# Altium schematic sheet PCBfly.SchDoc
size A3; SheetNumber: 1; SheetTotal: 1
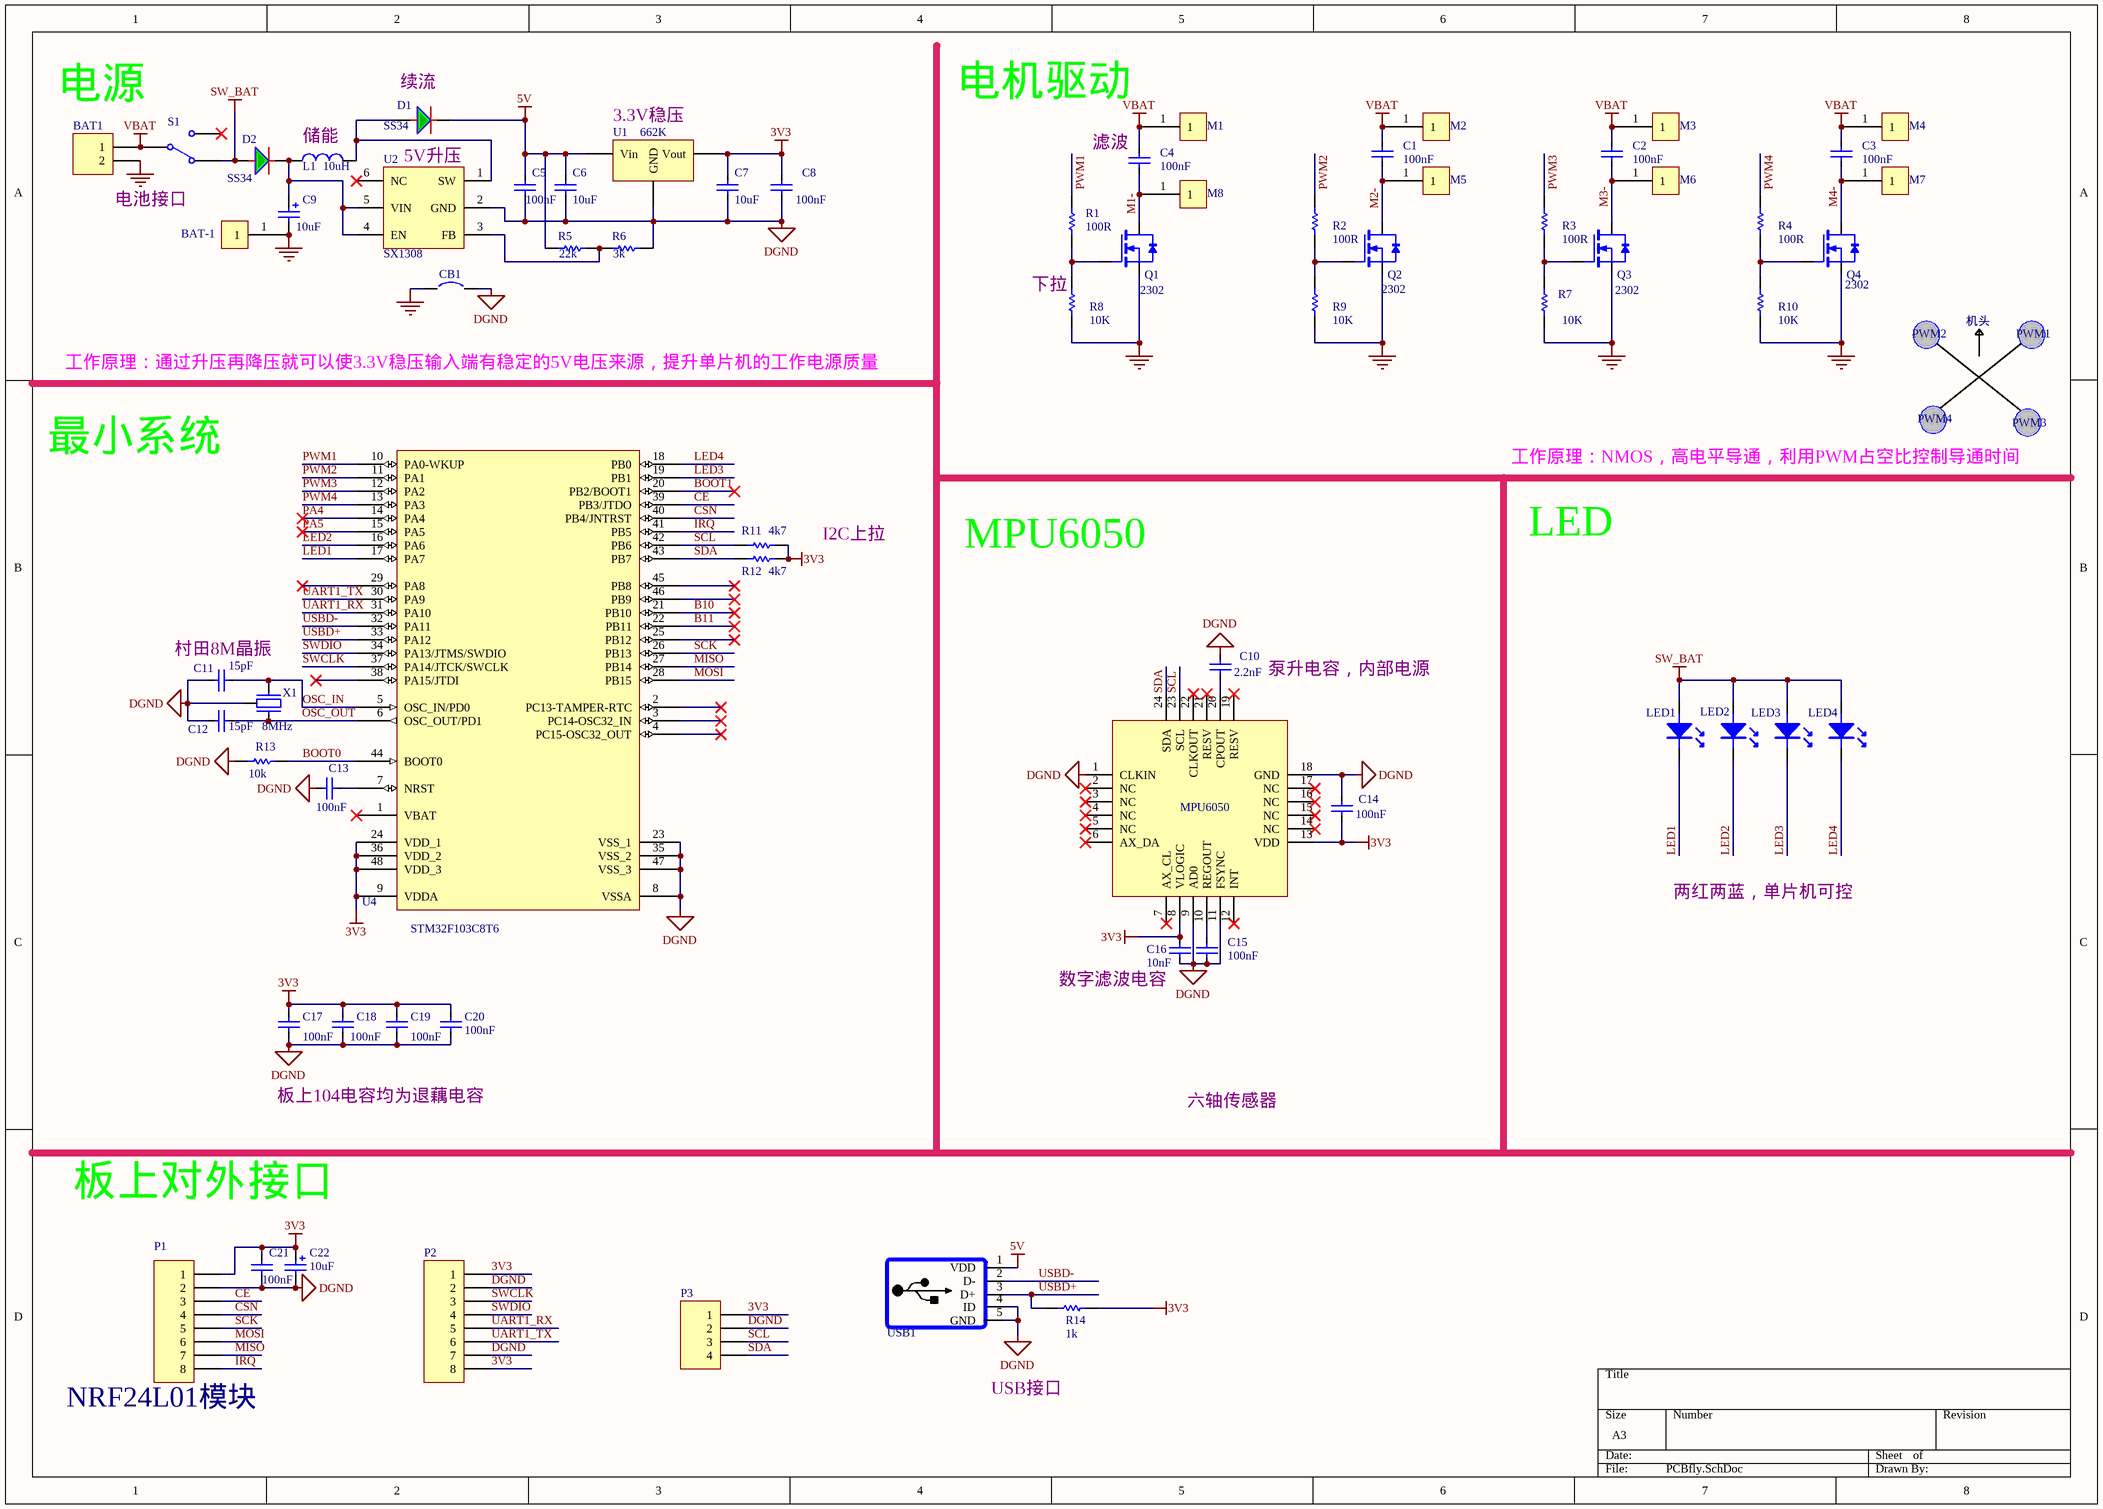
[diagram p0: PCBfly.SchDoc]

## Parts
BAT1  Header 2  [HDR2]  (value not drawn)
BAT-1  Header 1  [电池接口]  (value not drawn)
C1  100nF  [0805C]
C2  100nF  [0805C]
C3  100nF  [0805C]
C4  100nF  [0805C]
C5  100nF  [0805C]
C6  10uF  [0805C]
C7  10uF  [0805C]
C8  100nF  [0805C]
C9  10uF  [CTan(6032)]
C10  2.2nF  [0805C]
C11  15pF  [0805C]
C12  15pF  [0805C]
C13  100nF  [0805C]
C14  100nF  [0805C]
C15  100nF  [0805C]
C16  10nF  [0805C]
C17  100nF  [0805C]
C18  100nF  [0805C]
C19  100nF  [0805C]
C20  100nF  [0805C]
C21  100nF  [0805C]
C22  10uF  [CTan(6032)]
CB1  Circuit Breaker  [JUMP]  (value not drawn)
D1  SS34  [SMA]
D2  SS34  [SMA]
L1  10uH  [CD53]
LED1  LED  [LED 0805W]  (value not drawn)
LED2  LED  [LED 0805W]  (value not drawn)
LED3  LED  [LED 0805W]  (value not drawn)
LED4  LED  [LED 0805W]  (value not drawn)
M1  Header 1  [电池接口]  (value not drawn)
M2  Header 1  [电池接口]  (value not drawn)
M3  Header 1  [电池接口]  (value not drawn)
M4  Header 1  [电池接口]  (value not drawn)
M5  Header 1  [电池接口]  (value not drawn)
M6  Header 1  [电池接口]  (value not drawn)
M7  Header 1  [电池接口]  (value not drawn)
M8  Header 1  [电池接口]  (value not drawn)
P1  NRF24L01模块  [2.4G]
P2  Header 8  [HDR8]  (value not drawn)
P3  Header 4  [HDR2.54-LI-4P]  (value not drawn)
Q1  2302  [NMOS]
Q2  2302  [NMOS]
Q3  2302  [NMOS]
Q4  2302  [NMOS]
R1  100R  [0805R]
R2  100R  [0805R]
R3  100R  [0805R]
R4  100R  [0805R]
R5  22k  [0805R]
R6  3k  [0805R]
R7  10K  [0805R]
R8  10K  [0805R]
R9  10K  [0805R]
R10  10K  [0805R]
R11  4k7  [0805R]
R12  4k7  [0805R]
R13  10k  [0805R]
R14  1k  [0805R]
S1  SW-SPDT  [SWITCH]  (value not drawn)
U1  662K  [LDO]
U2  SX1308  [SOT23-6L]
U3  MPU6050  [QFN24]
U4  STM32F103C8T6  [LQFP48]
USB1  USB  [USB_micro]  (value not drawn)
X1  8MHz  [XTAL_3225-4P]

## Nets
3V3: C7.1 C8.1 C14.1 C16.2 C17.1 C18.1 C19.1 C20.1 C21.1 C22.2 P1.1 P2.1 P2.8 P3.1 R11.1 R12.1 R14.1 U1.2(Vout) U3.8(VLOGIC) U3.13(VDD) U4.9(VDDA) U4.24(VDD_1) U4.36(VDD_2) U4.48(VDD_3)
5V: C5.1 C6.1 D1.2 R5.1 U1.3(Vin) USB1.1(VDD)
DGND: C5.2 C6.2 C7.2 C8.2 C10.2 C11.2 C12.2 C13.1 C14.2 C15.1 C16.1 C17.2 C18.2 C19.2 C20.2 C21.2 C22.1 CB1.2 P1.2 P2.2 P2.7 P3.2 R6.1 R13.2 U1.1(GND) U2.2(GND) U3.1(CLKIN) U3.9(AD0) U3.11(FSYNC) U3.18(GND) U4.8(VSSA) U4.23(VSS_1) U4.35(VSS_2) U4.47(VSS_3) USB1.4(ID) USB1.5(GND) X1.2
GND: BAT1.2 BAT-1.1 C9.1 CB1.1 Q1.3(S) Q2.3(S) Q3.3(S) Q4.3(S) R7.1 R8.1 R9.1 R10.1
SW_BAT: D2.1 LED1.1 LED2.1 LED3.1 LED4.1 S1.3
VBAT: BAT1.1 C1.2 C2.2 C3.2 C4.2 M1.1 M2.1 M3.1 M4.1 S1.2
B10: U4.21(PB10)
B11: U4.22(PB11)
BOOT0: R13.1 U4.44(BOOT0)
BOOT1: U4.20(PB2/BOOT1)
CE: P1.3 U4.39(PB3/JTDO)
CSN: P1.4 U4.40(PB4/JNTRST)
IRQ: P1.8 U4.41(PB5)
LED1: LED1.2 U4.17(PA7)
LED2: LED2.2 U4.16(PA6)
LED3: LED3.2 U4.19(PB1)
LED4: LED4.2 U4.18(PB0)
M1-: C4.1 M8.1 Q1.2(D)
M2-: C1.1 M5.1 Q2.2(D)
M3-: C2.1 M6.1 Q3.2(D)
M4-: C3.1 M7.1 Q4.2(D)
MISO: P1.7 U4.27(PB14)
MOSI: P1.6 U4.28(PB15)
OSC_IN: C11.1 U4.5(OSC_IN/PD0) X1.3
OSC_OUT: C12.1 U4.6(OSC_OUT/PD1) X1.1
PA4: U4.14(PA4)
PA5: U4.15(PA5)
PWM1: R1.2 U4.10(PA0-WKUP)
PWM2: R2.2 U4.11(PA1)
PWM3: R3.2 U4.12(PA2)
PWM4: R4.2 U4.13(PA3)
SCK: P1.5 U4.26(PB13)
SCL: P3.3 R11.2 U3.23(SCL) U4.42(PB6)
SDA: P3.4 R12.2 U3.24(SDA) U4.43(PB7)
SWCLK: P2.3 U4.37(PA14/JTCK/SWCLK)
SWDIO: P2.4 U4.34(PA13/JTMS/SWDIO)
UART1_RX: P2.5 U4.31(PA10)
UART1_TX: P2.6 U4.30(PA9)
USBD+: R14.2 U4.33(PA12) USB1.3(D+)
USBD-: U4.32(PA11) USB1.2(D-)
NetC9_2: C9.2 D2.2 L1.1 U2.4(EN) U2.5(VIN)
NetC10_1: C10.1 U3.20(CPOUT)
NetC13_2: C13.2 U4.7(NRST)
NetC15_2: C15.2 U3.10(REGOUT)
NetD1_1: D1.1 L1.2 U2.1(SW)
NetQ1_1: Q1.1(G) R1.1 R8.2
NetQ2_1: Q2.1(G) R2.1 R9.2
NetQ3_1: Q3.1(G) R3.1 R7.2
NetQ4_1: Q4.1(G) R4.1 R10.2
NetR5_2: R5.2 R6.2 U2.3(FB)

Not connected (* = marked no-connect by the designer): S1 1*; U2 6(NC)*; U3 2(NC)* 3(NC)* 4(NC)* 5(NC)* 6(AX_DA)* 7(AX_CL)* 12(INT)* 14(NC)* 15(NC)* 16(NC)* 17(NC)* 19(RESV)* 21(RESV)* 22(CLKOUT)*; U4 1(VBAT)* 2(PC13-TAMPER-RTC)* 3(PC14-OSC32_IN)* 4(PC15-OSC32_OUT)* 25(PB12)* 29(PA8)* 38(PA15/JTDI)* 45(PB8)* 46(PB9)*

## Notes on the sheet
- (near BAT1) 电源
- (near D1) 续流
- 电机驱动
- (near L1) 储能
- (near U2) 5V升压
- (near U1) 3.3V稳压
- (near C4) 滤波
- 电池接口
- (near R8) 下拉
- 工作原理：通过升压再降压就可以使3.3V稳压输入端有稳定的5V电压来源，提升单片机的工作电源质量
- PWM2
- 机头
- PWM1
- PWM4
- PWM3
- 最小系统
- 工作原理：NMOS，高电平导通，利用PWM占空比控制导通时间
- I2C上拉
- MPU6050
- LED
- (near C11) 村田8M晶振
- 泵升电容，内部电源
- 两红两蓝，单片机可控
- 数字滤波电容
- 板上104电容均为退藕电容
- 六轴传感器
- 板上对外接口
- USB接口

## Library data of the parts
BAT1 = Header 2: Header, 2-Pin; LatestRevisionDate: 17-Jul-2002; LatestRevisionNote: Re-released for DXP Platform.; Publisher: Altium Limited
C1-C8 C10-C21 = Cap_MLCC: Capacitor
C9 C22 = Cap Tan A: Capacitor; Voltage: 16V; Published: 8-Jun-2000; Revision: July-2002: Re-released for DXP Platform.; Publisher: Altium Limited
D1 D2 = DIODE
L1 = Inductor Chip: Inductor; Published: 8-Jun-2000; Revision: July-2002: Re-released for DXP Platform.; Publisher: Altium Limited
P1 = NRF24L01模块: Header, 8-Pin; LatestRevisionDate: 17-Jul-2002; LatestRevisionNote: Re-released for DXP Platform.; Publisher: Altium Limited
P2 = Header 8: Header, 8-Pin; LatestRevisionDate: 17-Jul-2002; LatestRevisionNote: Re-released for DXP Platform.; Publisher: Altium Limited
P3 = Header 4: Header, 4-Pin; LatestRevisionDate: 17-Jul-2002; LatestRevisionNote: Re-released for DXP Platform.; Publisher: Altium Limited
Q1-Q4 = N_MOS: N-Channel Power MOSFET
R1-R14 = Res: Resistor; Published: 8-Jun-2000; LatestRevisionDate: 17-Jul-2002; LatestRevisionNote: Re-released for DXP Platform.; PackageReference: 0603_R; Publisher: Altium Limited; PackageDescription: Axial Device, Thru-Hole; 2 Leads; 0.3 in Pin Spacing
S1 = SW-SPDT: SPDT Subminiature Toggle Switch, Right Angle Mounting, Vertical Actuation; Published: 24-Mar-1999; LatestRevisionDate: 17-Dec-2003; LatestRevisionNote: Schematic revised, PCB Footprint replaced.; DatasheetVersion: 05-Dec-2000; PackageReference: TL36WW15050; Publisher: Altium Limited; PackageDescription: Switch; 4 Leads; ComponentLink1Description: Manufacturer Link; ComponentLink1URL: http://www.apem.com
U1 = LDO
X1 = XTAL_SMT
CB1 = Circuit Breaker: Published: 24-Mar-1999; LatestRevisionDate: 17-Jul-2002; LatestRevisionNote: Re-released for DXP Platform.; PackageReference: SPST-2; Publisher: Altium Limited